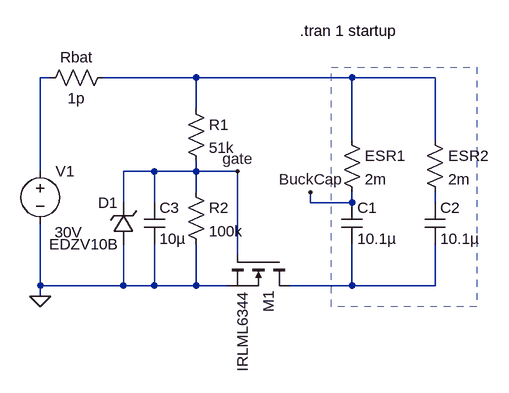
[diagram p0: schematic nmos_inrush_current_limiter.asc]
nmos_inrush_current_limiter.asc, the LTspice schematic file:
Version 4
SHEET 1 880 680
WIRE 16 64 0 64
WIRE 240 64 96 64
WIRE 480 64 240 64
WIRE 608 64 480 64
WIRE 240 112 240 64
WIRE 480 160 480 64
WIRE 608 160 608 64
WIRE 0 208 0 64
WIRE 176 208 128 208
WIRE 240 208 240 192
WIRE 240 208 176 208
WIRE 304 208 240 208
WIRE 240 240 240 208
WIRE 128 256 128 208
WIRE 176 256 176 208
WIRE 416 256 416 240
WIRE 480 256 480 240
WIRE 480 256 416 256
WIRE 608 256 608 240
WIRE 304 336 304 208
WIRE 0 384 0 288
WIRE 128 384 128 320
WIRE 128 384 0 384
WIRE 176 384 176 320
WIRE 176 384 128 384
WIRE 240 384 240 320
WIRE 240 384 176 384
WIRE 288 384 240 384
WIRE 480 384 480 320
WIRE 480 384 384 384
WIRE 608 384 608 320
WIRE 608 384 480 384
WIRE 0 400 0 384
FLAG 0 400 0
FLAG 304 208 gate
FLAG 416 240 BuckCap
SYMBOL voltage 0 192 R0
WINDOW 123 0 0 Left 0
WINDOW 39 0 0 Left 0
WINDOW 3 22 110 Left 2
SYMATTR Value 30V
SYMATTR InstName V1
SYMBOL cap 464 256 R0
SYMATTR InstName C1
SYMATTR Value 10.1µ
SYMBOL res 464 144 R0
SYMATTR InstName ESR1
SYMATTR Value 2m
SYMBOL res 0 80 R270
WINDOW 0 32 56 VTop 2
WINDOW 3 0 56 VBottom 2
SYMATTR InstName Rbat
SYMATTR Value 1p
SYMBOL res 592 144 R0
SYMATTR InstName ESR2
SYMATTR Value 2m
SYMBOL cap 592 256 R0
SYMATTR InstName C2
SYMATTR Value 10.1µ
SYMBOL cap 160 256 R0
SYMATTR InstName C3
SYMATTR Value 10µ
SYMBOL res 224 96 R0
SYMATTR InstName R1
SYMATTR Value 51k
SYMBOL res 224 224 R0
SYMATTR InstName R2
SYMATTR Value 100k
SYMBOL nmos 384 336 R90
SYMATTR InstName M1
SYMATTR Value IRLML6344
SYMBOL zener 144 320 R180
WINDOW 0 24 64 Left 2
WINDOW 3 24 0 Left 2
SYMATTR InstName D1
SYMATTR Value EDZV10B
SYMATTR Description Diode
SYMATTR Type diode
TEXT 400 -8 Left 2 !.tran 1 startup
RECTANGLE Normal 672 416 448 48 2

The netlist it stands for:
* nmos_inrush_current_limiter.asc
V1 N001 0 30V
C1 BuckCap N004 10.1µ
R§ESR1 N002 BuckCap 2m
Rbat N001 N002 1p
R§ESR2 N002 N003 2m
C2 N003 N004 10.1µ
C3 gate 0 10µ
R1 N002 gate 51k
R2 gate 0 100k
M1 N004 gate 0 0 IRLML6344
D1 0 gate EDZV10B
.model D D
.lib standard.dio
.model NMOS NMOS
.model PMOS PMOS
.lib standard.mos
.tran 1 startup
.backanno
.end